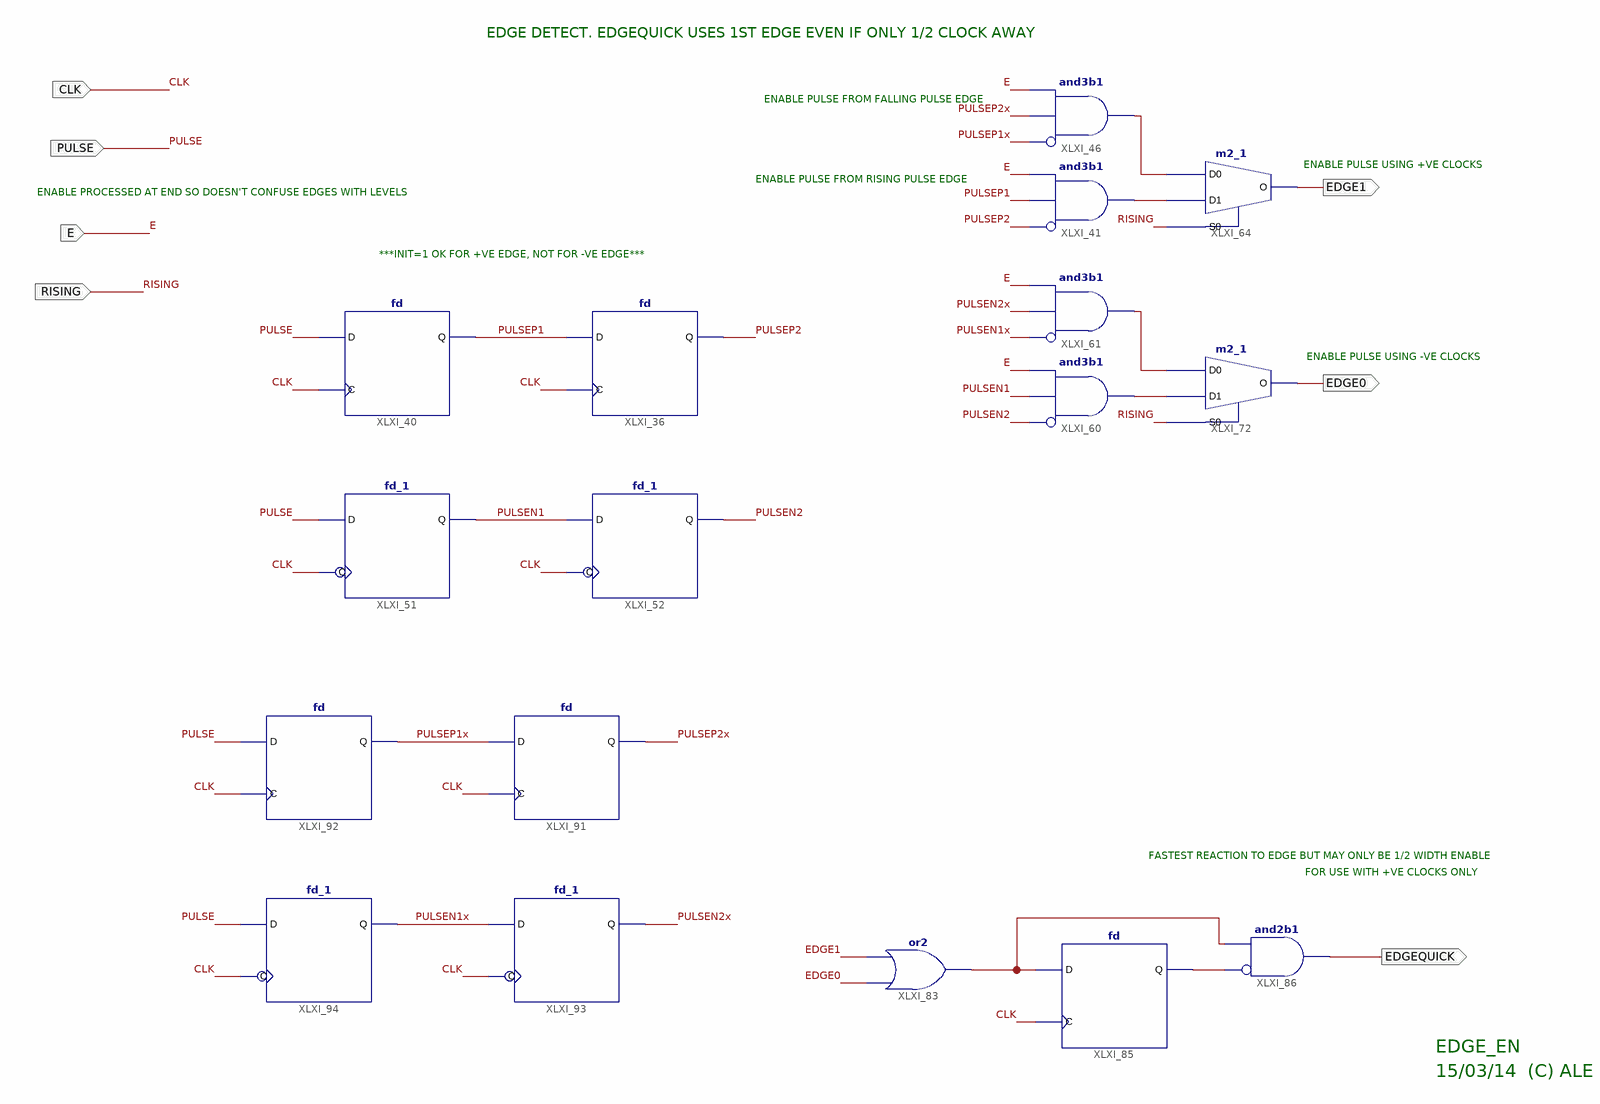
[diagram p0: schematic sheet 1]
// Xilinx ISE schematic Edge_En.sch (zynq) as structural Verilog: 17 symbols, 7 ports
module Edge_En (
  input  CLK,
  input  PULSE,
  input  E,
  input  RISING,
  output EDGE1,
  output EDGE0,
  output EDGEQUICK
);

  wire PULSEN1, PULSEN1x, PULSEN2, PULSEN2x, PULSEP1, PULSEP1x, PULSEP2, PULSEP2x, XLXN_141, XLXN_146,
       XLXN_168, XLXN_169, XLXN_208, XLXN_212;

  and XLXI_46 (XLXN_141, ~PULSEP1x, PULSEP2x, E);  // and3b1
  and XLXI_41 (XLXN_146, ~PULSEP2, PULSEP1, E);  // and3b1
  m2_1 XLXI_64 (.D0(XLXN_141), .D1(XLXN_146), .S0(RISING), .O(EDGE1));
  m2_1 XLXI_72 (.D0(XLXN_169), .D1(XLXN_168), .S0(RISING), .O(EDGE0));
  and XLXI_60 (XLXN_168, ~PULSEN2, PULSEN1, E);  // and3b1
  and XLXI_61 (XLXN_169, ~PULSEN1x, PULSEN2x, E);  // and3b1
  fd XLXI_85 (.C(CLK), .D(XLXN_208), .Q(XLXN_212));
  or XLXI_83 (XLXN_208, EDGE0, EDGE1);
  and XLXI_86 (EDGEQUICK, ~XLXN_212, XLXN_208);  // and2b1
  fd #(.INIT("1")) XLXI_36 (.C(CLK), .D(PULSEP1), .Q(PULSEP2));
  fd #(.INIT("1")) XLXI_40 (.C(CLK), .D(PULSE), .Q(PULSEP1));
  fd_1 #(.INIT("1")) XLXI_52 (.C(CLK), .D(PULSEN1), .Q(PULSEN2));
  fd_1 #(.INIT("1")) XLXI_51 (.C(CLK), .D(PULSE), .Q(PULSEN1));
  fd #(.INIT("0")) XLXI_91 (.C(CLK), .D(PULSEP1x), .Q(PULSEP2x));
  fd #(.INIT("0")) XLXI_92 (.C(CLK), .D(PULSE), .Q(PULSEP1x));
  fd_1 #(.INIT("0")) XLXI_93 (.C(CLK), .D(PULSEN1x), .Q(PULSEN2x));
  fd_1 #(.INIT("0")) XLXI_94 (.C(CLK), .D(PULSE), .Q(PULSEN1x));

  // Notes on the sheet:
  //   EDGE DETECT. EDGEQUICK USES 1ST EDGE EVEN IF ONLY 1/2 CLOCK AWAY
  //   ENABLE PULSE FROM FALLING PULSE EDGE
  //   ENABLE PULSE USING +VE CLOCKS
  //   ENABLE PULSE FROM RISING PULSE EDGE
  //   ENABLE PROCESSED AT END SO DOESN'T CONFUSE EDGES WITH LEVELS
  //   ***INIT=1 OK FOR +VE EDGE, NOT FOR -VE EDGE***
  //   ENABLE PULSE USING -VE CLOCKS
  //   FASTEST REACTION TO EDGE BUT MAY ONLY BE 1/2 WIDTH ENABLE
  //   FOR USE WITH +VE CLOCKS ONLY
  //   EDGE_EN
  //   15/03/14  (C) ALE
endmodule
